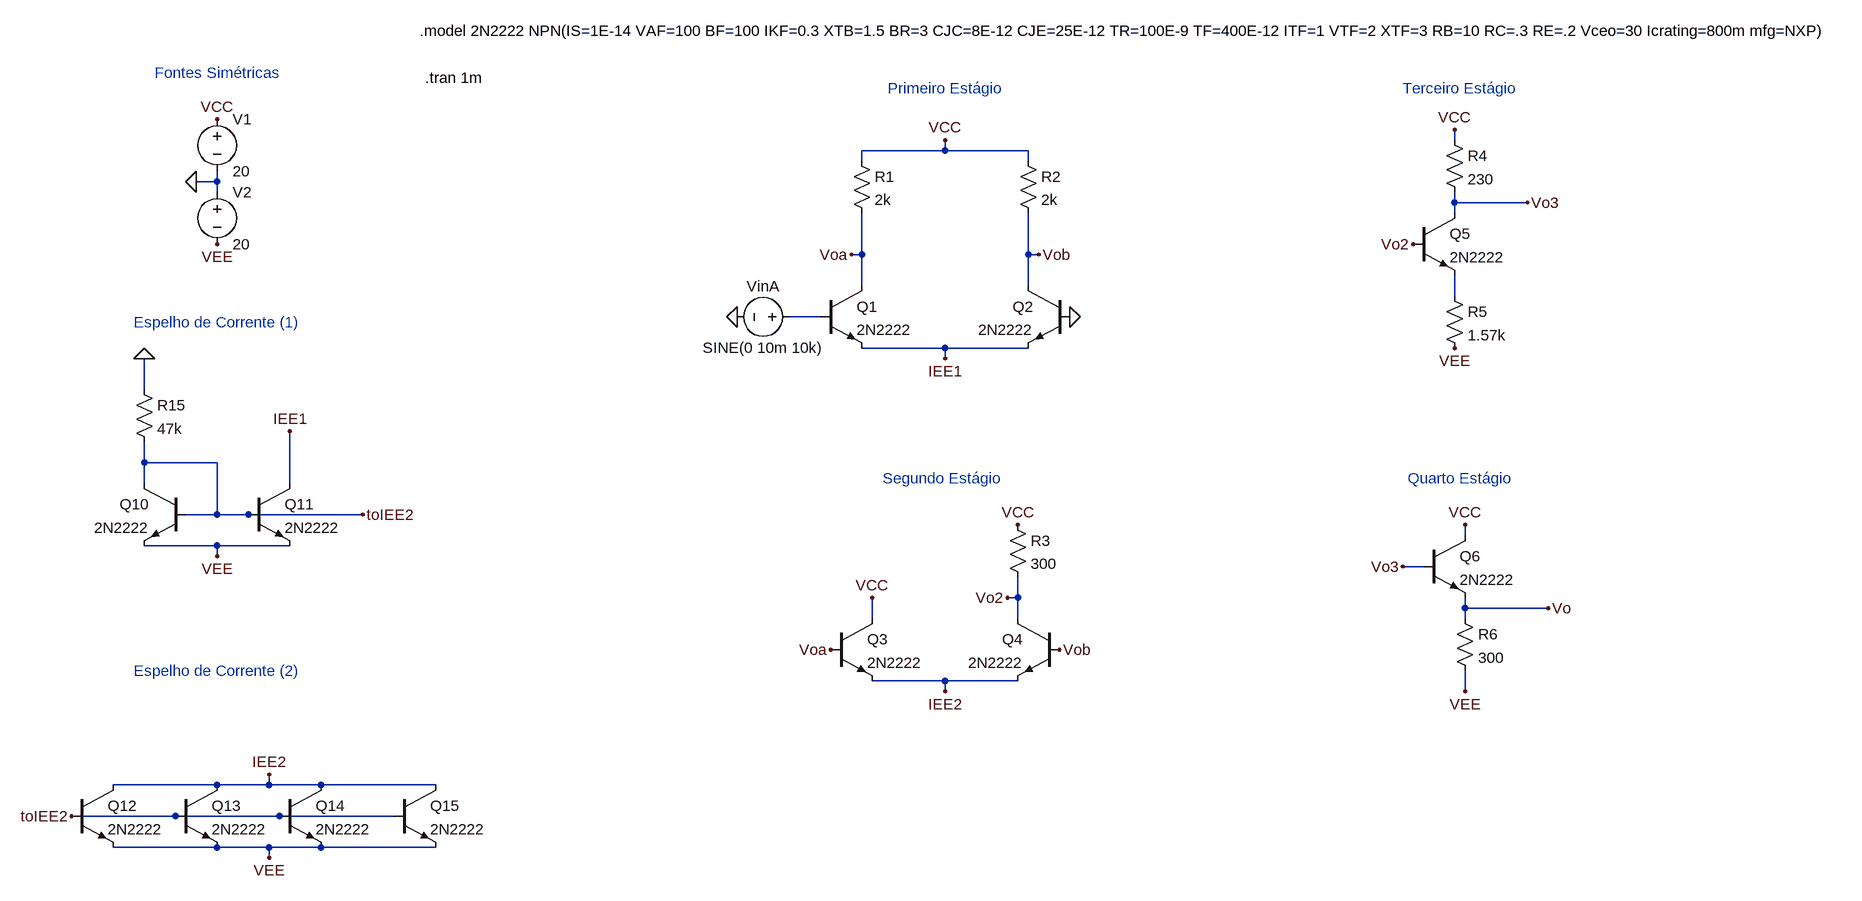
[diagram p0: schematic alternativo.asc]
alternativo.asc, the LTspice schematic file:
Version 4
SHEET 1 2724 1448
WIRE 1840 256 1840 240
WIRE 1056 272 1056 256
WIRE 1056 272 928 272
WIRE 1184 272 1056 272
WIRE 928 288 928 272
WIRE 1184 288 1184 272
WIRE -64 320 -64 304
WIRE -64 320 -96 320
WIRE -64 336 -64 320
WIRE 1840 352 1840 336
WIRE 1952 352 1840 352
WIRE 1840 368 1840 352
WIRE 928 432 928 368
WIRE 928 432 912 432
WIRE 1184 432 1184 368
WIRE 1200 432 1184 432
WIRE 928 480 928 432
WIRE 1184 480 1184 432
WIRE 1840 496 1840 464
WIRE 864 528 816 528
WIRE 1056 576 928 576
WIRE 1184 576 1056 576
WIRE 1056 592 1056 576
WIRE -176 640 -176 592
WIRE -176 752 -176 720
WIRE -64 752 -176 752
WIRE -176 784 -176 752
WIRE 48 784 48 704
WIRE -64 832 -64 752
WIRE -64 832 -112 832
WIRE -16 832 -64 832
WIRE 160 832 -16 832
WIRE 1856 864 1856 848
WIRE -64 880 -176 880
WIRE 48 880 -64 880
WIRE -64 896 -64 880
WIRE 1792 912 1760 912
WIRE 1168 960 1168 928
WIRE 1168 960 1152 960
WIRE 1856 976 1856 960
WIRE 1984 976 1856 976
WIRE 944 992 944 960
WIRE 1168 992 1168 960
WIRE 1856 992 1856 976
WIRE 1056 1088 944 1088
WIRE 1168 1088 1056 1088
WIRE 1056 1104 1056 1088
WIRE 1856 1104 1856 1072
WIRE -64 1248 -224 1248
WIRE 16 1248 16 1232
WIRE 16 1248 -64 1248
WIRE 96 1248 16 1248
WIRE 272 1248 96 1248
WIRE -128 1296 -288 1296
WIRE 32 1296 -128 1296
WIRE 208 1296 32 1296
WIRE -64 1344 -224 1344
WIRE 16 1344 -64 1344
WIRE 96 1344 16 1344
WIRE 272 1344 96 1344
WIRE 16 1360 16 1344
FLAG -96 320 0
FLAG -64 224 VCC
FLAG -64 416 VEE
FLAG -176 592 0
FLAG 48 704 IEE1
FLAG 1056 592 IEE1
FLAG -64 896 VEE
FLAG 1056 256 VCC
FLAG 1248 528 0
FLAG 736 528 0
FLAG 912 432 Voa
FLAG 1200 432 Vob
FLAG 880 1040 Voa
FLAG 1232 1040 Vob
FLAG 1168 848 VCC
FLAG 944 960 VCC
FLAG 1152 960 Vo2
FLAG 160 832 toIEE2
FLAG -288 1296 toIEE2
FLAG 16 1360 VEE
FLAG 16 1232 IEE2
FLAG 1056 1104 IEE2
FLAG 1840 240 VCC
FLAG 1840 576 VEE
FLAG 1776 416 Vo2
FLAG 1952 352 Vo3
FLAG 1856 848 VCC
FLAG 1856 1104 VEE
FLAG 1760 912 Vo3
FLAG 1984 976 Vo
SYMBOL voltage -64 208 R0
WINDOW 123 0 0 Left 0
WINDOW 39 0 0 Left 0
SYMATTR InstName V1
SYMATTR Value 20
SYMBOL voltage -64 320 R0
WINDOW 123 0 0 Left 0
WINDOW 39 0 0 Left 0
SYMATTR InstName V2
SYMATTR Value 20
SYMBOL npn -112 784 M0
SYMATTR InstName Q10
SYMATTR Value 2N2222
SYMBOL npn -16 784 R0
SYMATTR InstName Q11
SYMATTR Value 2N2222
SYMBOL res -192 624 R0
SYMATTR InstName R15
SYMATTR Value 47k
SYMBOL npn 864 480 R0
SYMATTR InstName Q1
SYMATTR Value 2N2222
SYMBOL npn 1248 480 M0
SYMATTR InstName Q2
SYMATTR Value 2N2222
SYMBOL res 912 272 R0
SYMATTR InstName R1
SYMATTR Value 2k
SYMBOL res 1168 272 R0
SYMATTR InstName R2
SYMATTR Value 2k
SYMBOL voltage 832 528 R90
WINDOW 0 -32 56 VBottom 2
WINDOW 3 32 56 VTop 2
WINDOW 123 0 0 Left 0
WINDOW 39 0 0 Left 0
SYMATTR InstName VinA
SYMATTR Value SINE(0 10m 10k)
SYMBOL npn 880 992 R0
SYMATTR InstName Q3
SYMATTR Value 2N2222
SYMBOL npn 1232 992 M0
SYMATTR InstName Q4
SYMATTR Value 2N2222
SYMBOL res 1152 832 R0
SYMATTR InstName R3
SYMATTR Value 300
SYMBOL npn -288 1248 R0
SYMATTR InstName Q12
SYMATTR Value 2N2222
SYMBOL npn -128 1248 R0
SYMATTR InstName Q13
SYMATTR Value 2N2222
SYMBOL npn 32 1248 R0
SYMATTR InstName Q14
SYMATTR Value 2N2222
SYMBOL npn 208 1248 R0
SYMATTR InstName Q15
SYMATTR Value 2N2222
SYMBOL res 1824 240 R0
SYMATTR InstName R4
SYMATTR Value 230
SYMBOL npn 1776 368 R0
SYMATTR InstName Q5
SYMATTR Value 2N2222
SYMBOL res 1824 480 R0
SYMATTR InstName R5
SYMATTR Value 1.57k
SYMBOL npn 1792 864 R0
SYMATTR InstName Q6
SYMATTR Value 2N2222
SYMBOL res 1840 976 R0
SYMATTR InstName R6
SYMATTR Value 300
TEXT -160 152 Left 2 ;Fontes Simétricas
TEXT -192 536 Left 2 ;Espelho de Corrente (1)
TEXT 968 176 Left 2 ;Primeiro Estágio
TEXT -192 1072 Left 2 ;Espelho de Corrente (2)
TEXT 248 88 Left 2 !.model 2N2222 NPN(IS=1E-14 VAF=100 BF=100 IKF=0.3 XTB=1.5 BR=3 CJC=8E-12 CJE=25E-12 TR=100E-9 TF=400E-12 ITF=1 VTF=2 XTF=3 RB=10 RC=.3 RE=.2 Vceo=30 Icrating=800m mfg=NXP)
TEXT 256 160 Left 2 !.tran 1m
TEXT 960 776 Left 2 ;Segundo Estágio
TEXT 1760 176 Left 2 ;Terceiro Estágio
TEXT 1768 776 Left 2 ;Quarto Estágio

The netlist it stands for:
* alternativo.asc
V1 VCC 0 20
V2 0 VEE 20
Q10 toIEE2 toIEE2 VEE 0 2N2222
Q11 IEE1 toIEE2 VEE 0 2N2222
R15 0 toIEE2 47k
Q1 Voa N002 IEE1 0 2N2222
Q2 Vob 0 IEE1 0 2N2222
R1 VCC Voa 2k
R2 VCC Vob 2k
VinA N002 0 SINE(0 10m 10k)
Q3 VCC Voa IEE2 0 2N2222
Q4 Vo2 Vob IEE2 0 2N2222
R3 VCC Vo2 300
Q12 IEE2 toIEE2 VEE 0 2N2222
Q13 IEE2 toIEE2 VEE 0 2N2222
Q14 IEE2 toIEE2 VEE 0 2N2222
Q15 IEE2 toIEE2 VEE 0 2N2222
R4 VCC Vo3 230
Q5 Vo3 Vo2 N001 0 2N2222
R5 N001 VEE 1.57k
Q6 VCC Vo3 Vo 0 2N2222
R6 Vo VEE 300
.model NPN NPN
.model PNP PNP
.lib standard.bjt
* Fontes Simétricas
* Espelho de Corrente (1)
* Primeiro Estágio
* Espelho de Corrente (2)
.model 2N2222 NPN(IS=1E-14 VAF=100 BF=100 IKF=0.3 XTB=1.5 BR=3 CJC=8E-12 CJE=25E-12 TR=100E-9 TF=400E-12 ITF=1 VTF=2 XTF=3 RB=10 RC=.3 RE=.2 Vceo=30 Icrating=800m mfg=NXP)
.tran 1m
* Segundo Estágio
* Terceiro Estágio
* Quarto Estágio
.backanno
.end